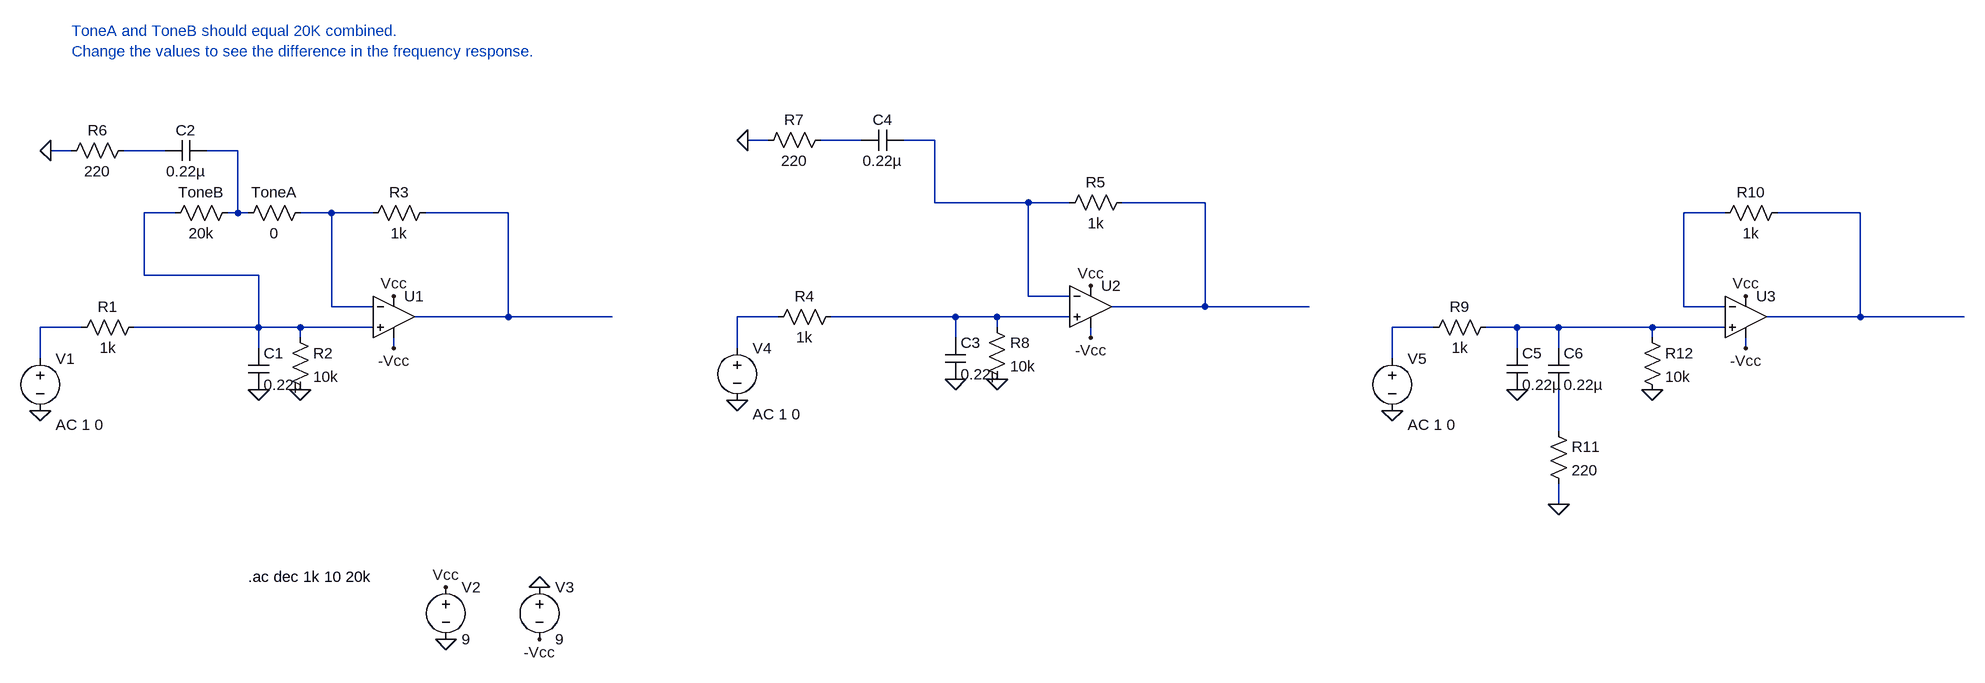
[diagram p0: schematic tone.asc]
tone.asc, the LTspice schematic file:
Version 4
SHEET 1 3044 724
WIRE 1136 -464 1104 -464
WIRE 1280 -464 1216 -464
WIRE 1392 -464 1344 -464
WIRE 64 -448 32 -448
WIRE 208 -448 144 -448
WIRE 320 -448 272 -448
WIRE 1392 -368 1392 -464
WIRE 1536 -368 1392 -368
WIRE 1600 -368 1536 -368
WIRE 1808 -368 1680 -368
WIRE 224 -352 176 -352
WIRE 320 -352 320 -448
WIRE 320 -352 304 -352
WIRE 336 -352 320 -352
WIRE 464 -352 416 -352
WIRE 528 -352 464 -352
WIRE 736 -352 608 -352
WIRE 2608 -352 2544 -352
WIRE 2816 -352 2688 -352
WIRE 176 -256 176 -352
WIRE 352 -256 176 -256
WIRE 1536 -224 1536 -368
WIRE 1600 -224 1536 -224
WIRE 464 -208 464 -352
WIRE 528 -208 464 -208
WIRE 1808 -208 1808 -368
WIRE 1808 -208 1664 -208
WIRE 1968 -208 1808 -208
WIRE 2544 -208 2544 -352
WIRE 2608 -208 2544 -208
WIRE 736 -192 736 -352
WIRE 736 -192 592 -192
WIRE 896 -192 736 -192
WIRE 1152 -192 1088 -192
WIRE 1424 -192 1232 -192
WIRE 1488 -192 1424 -192
WIRE 1600 -192 1488 -192
WIRE 2816 -192 2816 -352
WIRE 2816 -192 2672 -192
WIRE 2976 -192 2816 -192
WIRE 80 -176 16 -176
WIRE 352 -176 352 -256
WIRE 352 -176 160 -176
WIRE 416 -176 352 -176
WIRE 528 -176 416 -176
WIRE 1488 -176 1488 -192
WIRE 2160 -176 2096 -176
WIRE 2288 -176 2240 -176
WIRE 2352 -176 2288 -176
WIRE 2496 -176 2352 -176
WIRE 2608 -176 2496 -176
WIRE 416 -160 416 -176
WIRE 1424 -160 1424 -192
WIRE 1632 -160 1632 -176
WIRE 2496 -160 2496 -176
WIRE 352 -144 352 -176
WIRE 560 -144 560 -160
WIRE 1088 -144 1088 -192
WIRE 2288 -144 2288 -176
WIRE 2352 -144 2352 -176
WIRE 2640 -144 2640 -160
WIRE 16 -128 16 -176
WIRE 2096 -128 2096 -176
WIRE 2352 -16 2352 -80
WIRE 2352 96 2352 64
FLAG 640 304 0
FLAG 784 224 0
FLAG 640 224 Vcc
FLAG 784 304 -Vcc
FLAG 560 -144 -Vcc
FLAG 560 -224 Vcc
FLAG 16 -48 0
FLAG 32 -448 0
FLAG 352 -80 0
FLAG 416 -80 0
FLAG 1632 -160 -Vcc
FLAG 1632 -240 Vcc
FLAG 1088 -64 0
FLAG 1104 -464 0
FLAG 1424 -96 0
FLAG 1488 -96 0
FLAG 2640 -144 -Vcc
FLAG 2640 -224 Vcc
FLAG 2096 -48 0
FLAG 2496 -80 0
FLAG 2352 96 0
FLAG 2288 -80 0
SYMBOL voltage 640 208 R0
SYMATTR InstName V2
SYMATTR Value 9
SYMBOL voltage 784 208 R0
SYMATTR InstName V3
SYMATTR Value 9
SYMBOL OpAmps/UniversalOpAmp 560 -192 R0
SYMATTR InstName U1
SYMBOL voltage 16 -144 R0
WINDOW 123 24 118 Left 2
SYMATTR Value2 AC 1 0
SYMATTR InstName V1
SYMATTR Value ""
SYMBOL res 176 -192 R90
WINDOW 0 0 56 VBottom 2
WINDOW 3 32 56 VTop 2
SYMATTR InstName R1
SYMATTR Value 1k
SYMBOL cap 336 -144 R0
SYMATTR InstName C1
SYMATTR Value 0.22µ
SYMBOL res 624 -368 R90
WINDOW 0 0 56 VBottom 2
WINDOW 3 32 56 VTop 2
SYMATTR InstName R3
SYMATTR Value 1k
SYMBOL res 432 -368 R90
WINDOW 0 0 56 VBottom 2
WINDOW 3 32 56 VTop 2
SYMATTR InstName ToneA
SYMATTR Value 0
SYMBOL res 320 -368 R90
WINDOW 0 0 56 VBottom 2
WINDOW 3 32 56 VTop 2
SYMATTR InstName ToneB
SYMATTR Value 20k
SYMBOL res 160 -464 R90
WINDOW 0 0 56 VBottom 2
WINDOW 3 32 56 VTop 2
SYMATTR InstName R6
SYMATTR Value 220
SYMBOL cap 272 -464 R90
WINDOW 0 0 32 VBottom 2
WINDOW 3 32 32 VTop 2
SYMATTR InstName C2
SYMATTR Value 0.22µ
SYMBOL res 400 -176 R0
SYMATTR InstName R2
SYMATTR Value 10k
SYMBOL OpAmps/UniversalOpAmp 1632 -208 R0
SYMATTR InstName U2
SYMBOL voltage 1088 -160 R0
WINDOW 123 24 118 Left 2
SYMATTR Value2 AC 1 0
SYMATTR InstName V4
SYMATTR Value ""
SYMBOL res 1248 -208 R90
WINDOW 0 0 56 VBottom 2
WINDOW 3 32 56 VTop 2
SYMATTR InstName R4
SYMATTR Value 1k
SYMBOL cap 1408 -160 R0
SYMATTR InstName C3
SYMATTR Value 0.22µ
SYMBOL res 1696 -384 R90
WINDOW 0 0 56 VBottom 2
WINDOW 3 32 56 VTop 2
SYMATTR InstName R5
SYMATTR Value 1k
SYMBOL res 1232 -480 R90
WINDOW 0 0 56 VBottom 2
WINDOW 3 32 56 VTop 2
SYMATTR InstName R7
SYMATTR Value 220
SYMBOL cap 1344 -480 R90
WINDOW 0 0 32 VBottom 2
WINDOW 3 32 32 VTop 2
SYMATTR InstName C4
SYMATTR Value 0.22µ
SYMBOL res 1472 -192 R0
SYMATTR InstName R8
SYMATTR Value 10k
SYMBOL OpAmps/UniversalOpAmp 2640 -192 R0
SYMATTR InstName U3
SYMBOL voltage 2096 -144 R0
WINDOW 123 24 118 Left 2
SYMATTR Value2 AC 1 0
SYMATTR InstName V5
SYMATTR Value ""
SYMBOL res 2256 -192 R90
WINDOW 0 0 56 VBottom 2
WINDOW 3 32 56 VTop 2
SYMATTR InstName R9
SYMATTR Value 1k
SYMBOL res 2704 -368 R90
WINDOW 0 0 56 VBottom 2
WINDOW 3 32 56 VTop 2
SYMATTR InstName R10
SYMATTR Value 1k
SYMBOL res 2480 -176 R0
SYMATTR InstName R12
SYMATTR Value 10k
SYMBOL res 2336 -32 R0
SYMATTR InstName R11
SYMATTR Value 220
SYMBOL cap 2336 -144 R0
SYMATTR InstName C6
SYMATTR Value 0.22µ
SYMBOL cap 2272 -144 R0
SYMATTR InstName C5
SYMATTR Value 0.22µ
TEXT 336 208 Left 2 !.ac dec 1k 10 20k
TEXT 64 -632 Left 2 ;ToneA and ToneB should equal 20K combined.\nChange the values to see the difference in the frequency response.

The netlist it stands for:
* tone.asc
V2 Vcc 0 9
V3 0 -Vcc 9
XU1 N006 N007 Vcc -Vcc N008 level1 Avol=1Meg GBW=10Meg Vos=0 En=0 Enk=0 In=0 Ink=0 Rin=500Meg  ; pins In+ In- V+ V- OUT
V1 N013 0 AC 1 0
R1 N006 N013 1k
C1 N006 0 0.22µ
R3 N008 N007 1k
R§ToneA N007 N004 0
R§ToneB N004 N006 20k
R6 N003 0 220
C2 N004 N003 0.22µ
R2 N006 0 10k
XU2 N012 N002 Vcc -Vcc N005 level1 Avol=1Meg GBW=10Meg Vos=0 En=0 Enk=0 In=0 Ink=0 Rin=500Meg  ; pins In+ In- V+ V- OUT
V4 N011 0 AC 1 0
R4 N012 N011 1k
C3 N012 0 0.22µ
R5 N005 N002 1k
R7 N001 0 220
C4 N002 N001 0.22µ
R8 N012 0 10k
XU3 N015 N009 Vcc -Vcc N010 level1 Avol=1Meg GBW=10Meg Vos=0 En=0 Enk=0 In=0 Ink=0 Rin=500Meg  ; pins In+ In- V+ V- OUT
V5 N014 0 AC 1 0
R9 N015 N014 1k
R10 N010 N009 1k
R12 N015 0 10k
R11 N016 0 220
C6 N015 N016 0.22µ
C5 N015 0 0.22µ
.ac dec 1k 10 20k
* ToneA and ToneB should equal 20K combined.
* Change the values to see the difference in the frequency response.
.lib UniversalOpAmp1.lib
.backanno
.end